# EAGLE design max_plate (EAGLE 7.2.0)
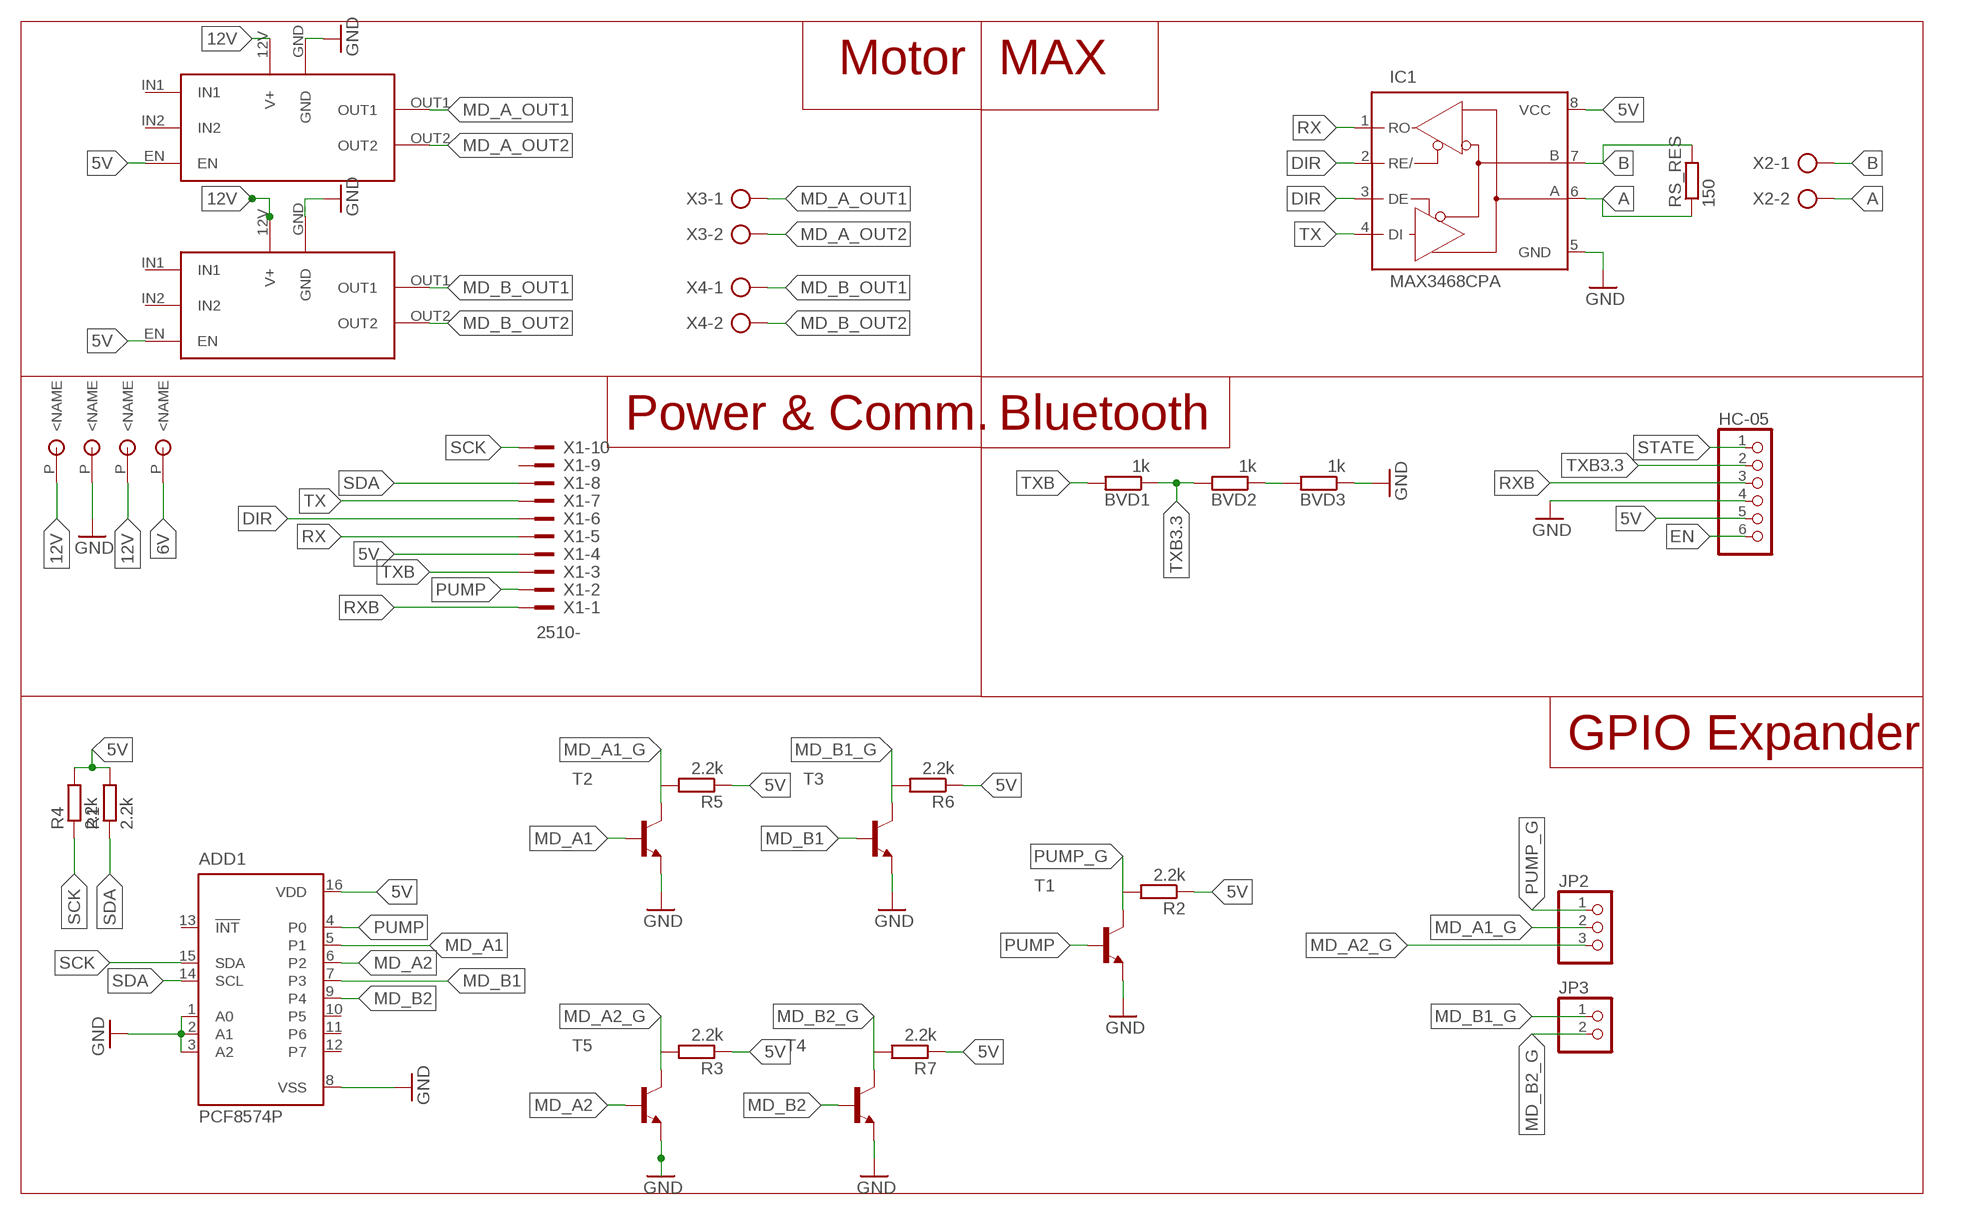
[diagram p0: schematic, sheet 1]

## Parts
ADD1  PCF8574P  [DIL16]
BVD1  1k  R-EU_0207/10  [0207/10]
BVD2  1k  R-EU_0207/10  [0207/10]
BVD3  1k  R-EU_0207/10  [0207/10]
HC-05  PINHD-1X6  [1X06]
IC1  MAX3468CPA  [DIL08]
JP2  PINHD-1X3  [1X03]
JP3  PINHD-1X2  [1X02]
R1  2.2k  R-EU_0207/10  [0207/10]
R2  2.2k  R-EU_0207/10  [0207/10]
R3  2.2k  R-EU_0207/10  [0207/10]
R4  2.2k  R-EU_0207/10  [0207/10]
R5  2.2k  R-EU_0207/10  [0207/10]
R6  2.2k  R-EU_0207/10  [0207/10]
R7  2.2k  R-EU_0207/10  [0207/10]
RS_RES  150  R-EU_0207/10  [0207/10]
T1  -NPN-TO92  [TO92]
T2  -NPN-TO92  [TO92]
T3  -NPN-TO92  [TO92]
T4  -NPN-TO92  [TO92]
T5  -NPN-TO92  [TO92]
U$1  CU-SPACER  [CU-SPACER]
U$2  CU-SPACER  [CU-SPACER]
U$3  CU-SPACER  [CU-SPACER]
U$4  CU-SPACER  [CU-SPACER]
U$5  L6203-MODULE  [L6203-MODULE]
U$6  L6203-MODULE  [L6203-MODULE]
X1  2510-  [PAK100/2500-10]
X2  AK500/2  [AK500/2]
X3  AK500/2  [AK500/2]
X4  AK500/2  [AK500/2]

## Nets
5V: ADD1.16(VDD) HC-05.5 IC1.8(VCC) R1.2 R2.1 R3.1 R4.2 R5.1 R6.1 R7.1 U$5.EN U$6.EN X1.4
6V: U$4.P(<NAME)
12V: U$1.P(<NAME) U$3.P(<NAME) U$5.12V(V+) U$6.12V(V+)
A: IC1.6(A) RS_RES.1 X2.2
B: IC1.7(B) RS_RES.2 X2.1
DIR: IC1.2(RE/) IC1.3(DE) X1.6
EN: HC-05.6
GND: ADD1.1(A0) ADD1.2(A1) ADD1.3(A2) ADD1.8(VSS) BVD3.1 HC-05.4 IC1.5(GND) T1.1(E) T2.1(E) T3.1(E) T4.1(E) T5.1(E) U$2.P(<NAME) U$5.GND U$6.GND
MD_A1: ADD1.5(P1) T2.2(B)
MD_A1_G: JP2.2 R5.2 T2.3(C)
MD_A2: ADD1.6(P2) T5.2(B)
MD_A2_G: JP2.3 R3.2 T5.3(C)
MD_A_OUT1: U$5.OUT1 X3.1
MD_A_OUT2: U$5.OUT2 X3.2
MD_B1: ADD1.7(P3) T3.2(B)
MD_B1_G: JP3.1 R6.2 T3.3(C)
MD_B2: ADD1.9(P4) T4.2(B)
MD_B2_G: JP3.2 R7.2 T4.3(C)
MD_B_OUT1: U$6.OUT1 X4.1
MD_B_OUT2: U$6.OUT2 X4.2
N$3: BVD2.1 BVD3.2
PUMP: ADD1.4(P0) T1.2(B) X1.2
PUMP_G: JP2.1 R2.2 T1.3(C)
RX: IC1.1(RO) X1.5
RXB: HC-05.3 X1.1
SCK: ADD1.15(SDA) R4.1 X1.10
SDA: ADD1.14(SCL) R1.1 X1.8
STATE: HC-05.1
TX: IC1.4(DI) X1.7
TXB: BVD1.2 X1.3
TXB3.3: BVD1.1 BVD2.2 HC-05.2
Unconnected: ADD1.10(P5) ADD1.11(P6) ADD1.12(P7) ADD1.13(!INT) U$5.IN1 U$5.IN2 U$6.IN1 U$6.IN2 X1.9

## Notes on the sheet
- Motor | MAX
- Power & Comm. | Bluetooth
- GPIO Expander

## Library data of the parts
ADD1 = micro-philips:PCF8574: I2C-Bus Remote 8-bit I/O expander http://www.semiconductors.philips.com/acrobat_download/datasheets/PCF8574_4.pdf; MPN: PCF8574PN; OC_FARNELL: 204020; OC_NEWARK: 11N8515
BVD1-BVD3 R1-R7 RS_RES = rcl:R-EU_: RESISTOR, European symbol
HC-05 = pinhead:PINHD-1X6: PIN HEADER
IC1 = maxim:MAX34*: +5V, Fail-Safe, 40Mbps, Profibus RS-485/RS-422 Transceivers Source: MAX3465-MAX3469.pdf; OC_FARNELL: unknown; OC_NEWARK: unknown
JP2 = pinhead:PINHD-1X3: PIN HEADER
JP3 = pinhead:PINHD-1X2: PIN HEADER
T1-T5 = transistor:*-NPN-: NPN Transistror BF959 corrected 2008.03.06
U$1-U$4 = Aquaphoton:CU-SPACER
U$5 U$6 = Aquaphoton:L6203-MODULE
X1 = con-3m:2510-: 3M (TM) Pak 100 4-Wall Header Source: 3M; MF: 3M; MPN: 2510-6002UB; OC_FARNELL: 9838244; OC_NEWARK: 46F4725
X2-X4 = con-ptr500:AK500/2: CONNECTOR; OC_FARNELL: unknown; OC_NEWARK: unknown

## Board
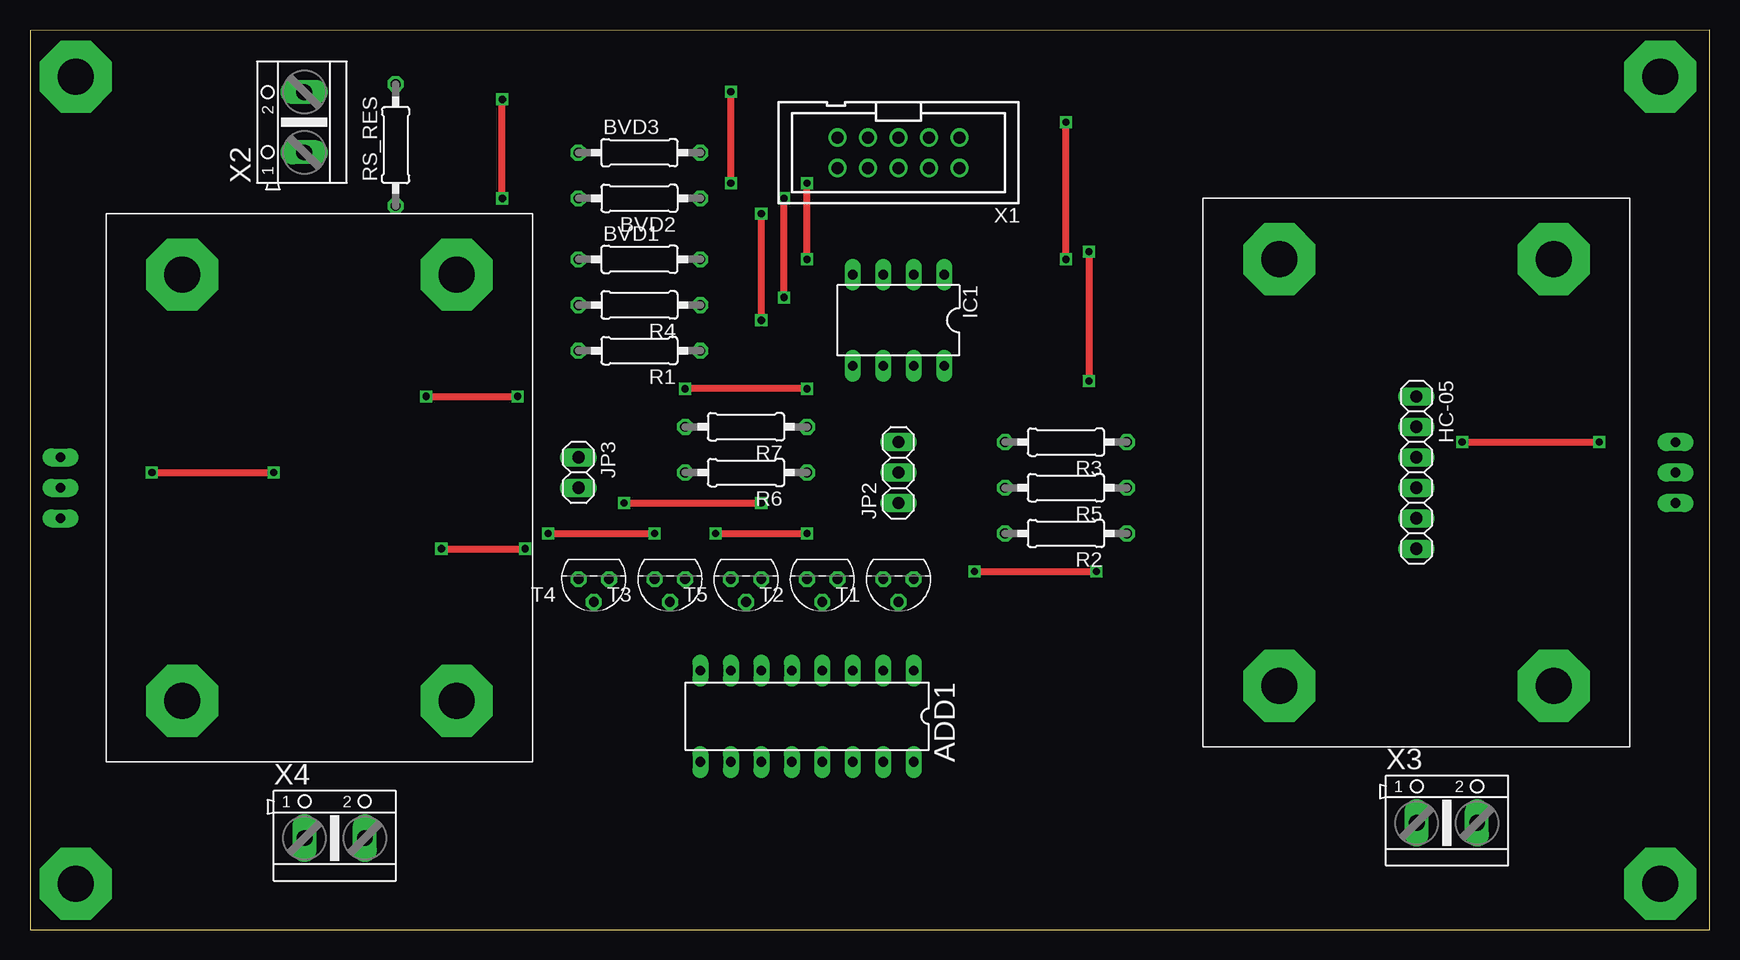
[diagram p1: board, top side]
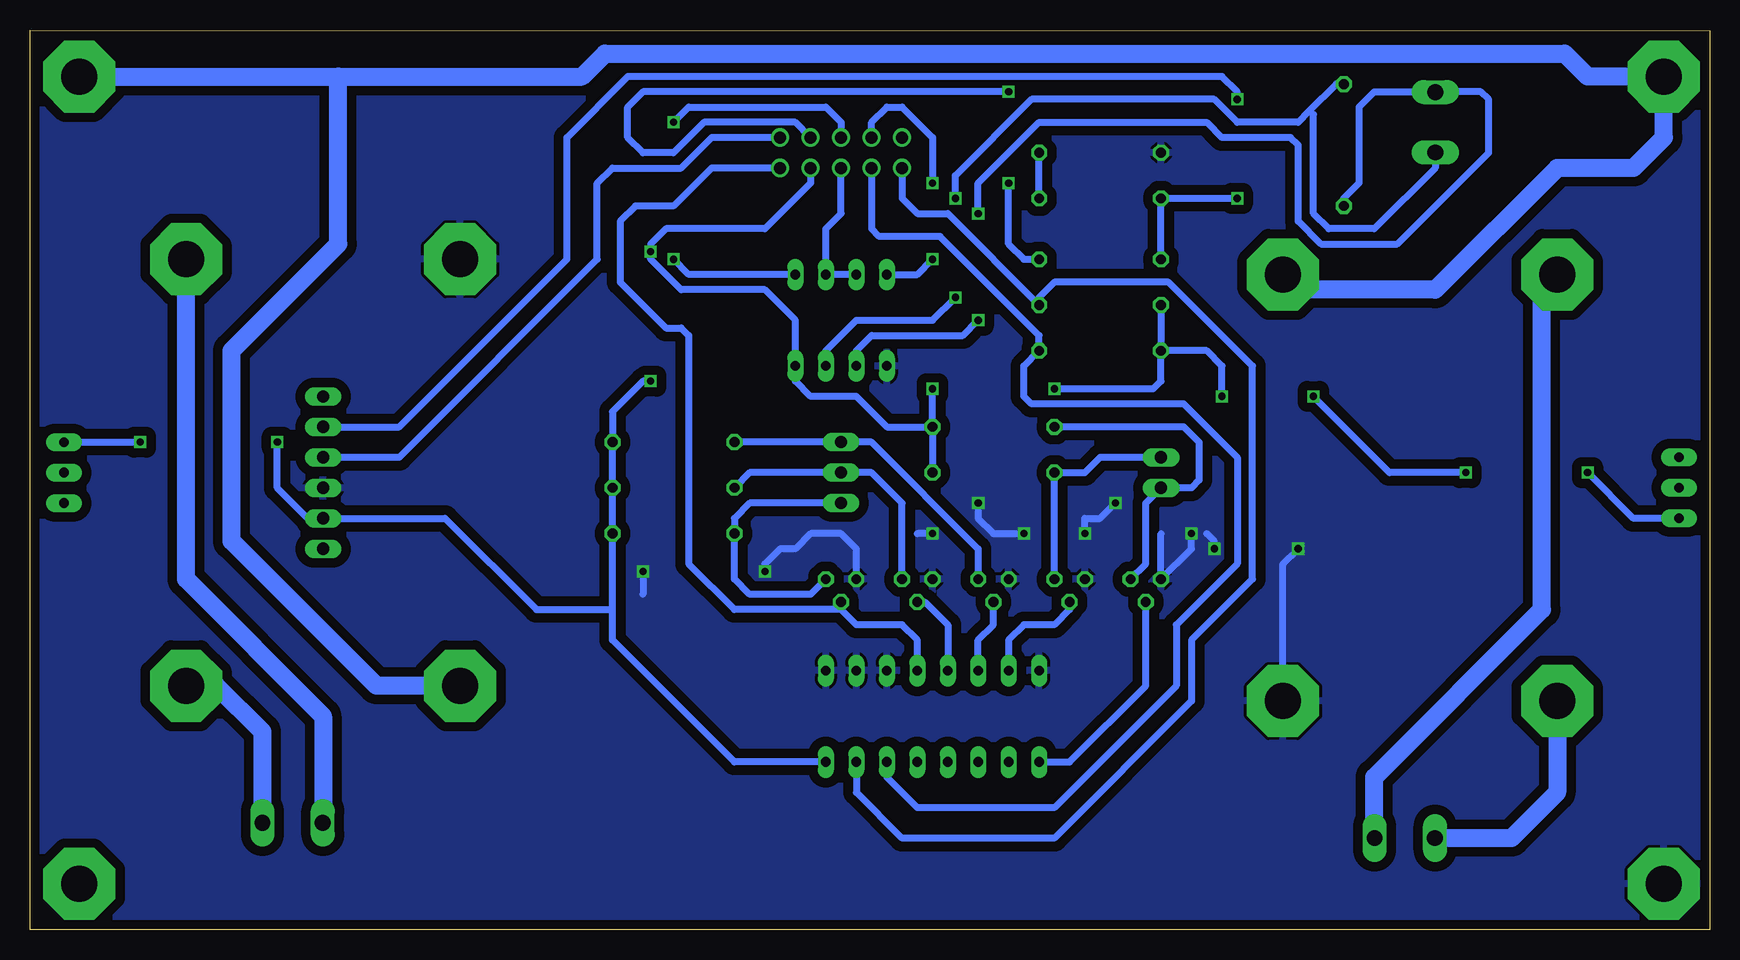
[diagram p2: board, bottom side, seen from below]

Size 140 x 75 mm. Coordinates in mm from the lower left corner, seen from the top.
Outline: 0,0 140,0 140,75 0,74.93 0,0
Copper layers (1*16): Top 0.035mm / dielectric 1.5mm / Bottom 0.035mm
Design rules "default *": minimum track width 0.8mm, minimum drill 0.8mm, track to track 0.8mm, track to pad 0.8mm, pad to pad 0.8mm, via to via 0.8mm, smd to smd 0.8mm, copper to edge 0.8mm, drill to drill 0.8mm, minimum pad ring 10mil, minimum via ring 8mil, stop-mask expansion 4mil, vias tented up to drill 0mil, thermal gap 10mil

### Footprints (pad centres in the part's own frame; a part is rotated, then mirrored left to right if it is on the bottom)
DIL16 = drill 0.813 long: 1 -8.89,-3.81; 2 -6.35,-3.81; 3 -3.81,-3.81; 4 -1.27,-3.81; 5 1.27,-3.81; 6 3.81,-3.81; 7 6.35,-3.81; 8 8.89,-3.81; 9 8.89,3.81; 10 6.35,3.81; 11 3.81,3.81; 12 1.27,3.81; 13 -1.27,3.81; 14 -3.81,3.81; 15 -6.35,3.81; 16 -8.89,3.81
0207/10 = drill 0.813 octagon: 1 -5.08,0; 2 5.08,0
1X06 = drill 1.016 long: 1 -6.35,0; 2 -3.81,0; 3 -1.27,0; 4 1.27,0; 5 3.81,0; 6 6.35,0
DIL08 = drill 0.813 long: 1 -3.81,-3.81; 2 -1.27,-3.81; 3 1.27,-3.81; 4 3.81,-3.81; 5 3.81,3.81; 6 1.27,3.81; 7 -1.27,3.81; 8 -3.81,3.81
1X03 = drill 1.016 long: 1 -2.54,0; 2 0,0; 3 2.54,0
1X02 = drill 1.016 long: 1 -1.27,0; 2 1.27,0
TO92 = drill 0.813 octagon: 1 1.27,0; 2 0,1.905; 3 -1.27,0
CU-SPACER = drill 3 pad 6 octagon: P 0,0
L6203-MODULE = drill 3 pad 6 octagon: 12V 5.08,29.21; GND 40.64,29.21; OUT1 40.64,6.35; OUT2 5.08,6.35 | drill 0.8 pad 1.5 long: EN 25.4,-3.81; IN1 20.32,-3.81; IN2 22.86,-3.81
PAK100/2500-10 = drill 1 pad 1.422: 1 -5.08,-1.27; 2 -5.08,1.27; 3 -2.54,-1.27; 4 -2.54,1.27; 5 0,-1.27; 6 0,1.27; 7 2.54,-1.27; 8 2.54,1.27; 9 5.08,-1.27; 10 5.08,1.27
AK500/2 = drill 1.321 long: 1 -2.515,0; 2 2.515,0

### Placement (x,y rotation side)
ADD1  64.77,17.78 180 top
BVD1  50.8,55.88 0 top
BVD2  50.8,60.96 180 top
BVD3  50.8,64.77 0 top
HC-05  115.57,38.1 270 top
IC1  72.39,50.8 180 top
JP2  72.39,38.1 90 top
JP3  45.72,38.1 270 top
R1  50.8,48.26 180 top
R2  86.36,33.02 180 top
R3  86.36,40.64 180 top
R4  50.8,52.07 180 top
R5  86.36,36.83 180 top
R6  59.69,38.1 180 top
R7  59.69,41.91 180 top
RS_RES  30.48,65.41 90 top
T1  72.39,29.21 180 top
T2  66.04,29.21 180 top
T3  53.34,29.21 180 top
T4  46.99,29.21 180 top
T5  59.69,29.21 180 top
U$1  135.89,71.12 0 top
U$2  3.81,3.81 0 top
U$3  3.81,71.12 0 top
U$4  135.89,3.81 0 top
U$5  133.35,15.24 90 top
U$6  6.35,59.69 270 top
X1  72.39,64.77 180 top
X2  22.86,67.31 90 top
X3  118.11,8.89 0 top
X4  25.4,7.62 0 top

### Tracks (layer width: path | path; a pad name or v marks a point on that pad's centre or on a via)
5V  (via drill 0.6)
  Top 0.6: v119.38,40.64 v130.81,40.64 | v88.27,56.52 v88.27,45.72 | v10.16,38.1 v20.32,38.1 | v33.02,44.45 v40.64,44.45 | v64.77,45.09 v54.61,45.09
  Bottom 0.6: ADD1.16 81.28,13.97 91.44,24.13 91.44,26.67 | 91.44,26.67 R2.1 R5.1 R3.1 91.44,43.18 88.9,45.72 v88.27,45.72 | R7.1 R6.1 | R4.2 R1.2 | R7.1 68.58,41.91 71.12,44.45 74.93,44.45 76.2,45.72 IC1.8 76.2,50.8 78.74,53.34 85.72,53.34 88.27,55.88 v88.27,56.52 88.27,57.15 87,58.42 78.74,58.42 74.93,62.23 X1.4 | U$5.EN v130.81,40.64 | 91.44,26.67 97.79,26.67 105.41,34.29 HC-05.5 116.84,34.29 119.38,36.83 v119.38,40.64 | U$6.EN 6.35,34.29 v10.16,38.1 | v20.32,38.1 26.67,38.1 v33.02,44.45 | v40.64,44.45 40.64,46.99 41.91,48.26 R1.2 | R7.1 v64.77,45.09 | v54.61,45.09 46.35,45.09 45.72,45.72 R1.2
12V
  Bottom 1.5: U$6.12V 34.29,53.34 22.86,53.34 12.7,63.5 6.35,63.5 3.81,66.04 U$3.P 10.16,71.12 12.06,73.03 92.08,73.03 93.98,71.12 114.3,71.12 | U$1.P 114.3,71.12 | U$5.12V 111.12,20.32 123.19,32.38 123.19,48.26 114.3,57.15 114.3,71.12
A  (via drill 0.6)
  Top 0.6: v60.96,50.8 v60.96,59.69
  Bottom 0.6: IC1.6 71.12,48.26 69.85,49.53 62.23,49.53 v60.96,50.8 | v60.96,59.69 60.96,62.23 55.88,67.31 41.91,67.31 40.64,66.04 34.92,66.04 34.29,65.41 34.29,59.05 32.38,57.15 26.04,57.15 18.41,64.77 18.41,69.22 19.05,69.85 22.84,69.85 X2.2 27.96,69.83 29.21,68.58 29.21,62.23 30.48,60.96 RS_RES.1
B  (via drill 0.6)
  Top 0.6: v62.87,52.7 v62.87,60.96
  Bottom 0.6: IC1.7 73.66,48.26 71.12,50.8 64.77,50.8 v62.87,52.7 | v62.87,60.96 62.87,62.87 56.52,69.22 41.27,69.22 39.37,67.31 34.29,67.31 33.34,68.26 | X2.1 22.86,63.5 27.94,58.42 31.75,58.42 33.02,59.69 33.02,67.94 33.34,68.26 | 33.34,68.26 31.11,70.48 RS_RES.2
DIR
  Bottom 0.6: IC1.3 IC1.2 73.66,58.42 72.39,59.69 X1.6
GND  (via drill 0.6)
  Top 0.6: v43.18,33.02 v52.07,33.02 | v49.53,35.56 v60.96,35.56 | v57.15,33.02 v64.77,33.02 | v78.74,29.84 v88.9,29.84 | v34.29,31.75 v41.27,31.75
  Bottom 0.6: 45.72,33.02 T4.1 43.18,31.75 v43.18,33.02 | v52.07,33.02 52.07,34.29 50.8,34.29 v49.53,35.56 | v60.96,35.56 60.96,34.29 59.69,33.02 v57.15,33.02 | v64.77,33.02 66.04,33.02 | T1.1 71.12,31.75 72.39,33.02 74.93,33.02 76.2,31.75 77.47,31.75 78.74,30.48 v78.74,29.84 | v88.9,29.84 88.9,27.94 | U$6.GND 35.56,30.48 v34.29,31.75 | v41.27,31.75 41.27,32.38 41.91,33.02
  pour Bottom: 0,74.93 140.97,74.93 140.97,-1.27 0,-1.27
MD_A1
  Bottom 0.6: ADD1.5 63.5,25.4 65.41,27.3 T2.2
MD_A1_G
  Bottom 0.6: T2.3 67.31,35.56 69.85,38.1 JP2.2 80.01,38.1 R5.2
MD_A2
  Bottom 0.6: ADD1.6 60.96,24.13 59.69,25.4 T5.2
MD_A2_G
  Bottom 0.6: R3.2 JP2.3 69.85,40.64 60.96,31.75 T5.3
MD_A_OUT1
  Bottom 1.5: U$5.OUT1 127,29.21 115.57,17.78 115.57,8.91 X3.1
MD_A_OUT2
  Bottom 1.5: X3.2 120.62,16.48 124.46,20.32 U$5.OUT2 128.27,20.32
MD_B1
  Bottom 0.6: ADD1.7 58.42,24.13 57.15,25.4 54.61,25.4 53.34,26.67 T3.2
MD_B1_G
  Bottom 0.6: JP3.1 50.8,39.37 52.07,38.1 R6.2 T3.3
MD_B2
  Bottom 0.6: ADD1.9 53.34,13.97 46.99,20.32 T4.2
MD_B2_G
  Bottom 0.6: JP3.2 44.45,36.83 | R7.2 43.81,41.91 42.55,40.64 42.55,37.47 43.18,36.83 JP3.2 | JP3.2 46.99,35.56 46.99,30.48 T4.3
MD_B_OUT1
  Bottom 1.5: U$6.OUT1 12.7,11.43 16.51,7.62 X4.1
MD_B_OUT2
  Bottom 1.5: U$6.OUT2 13.97,53.34 13.97,26.67 27.94,12.7 27.94,6.38 X4.2
N$3
  Bottom 0.6: BVD2.1 BVD3.2
PUMP
  Bottom 0.6: ADD1.4 66.04,24.13 67.31,25.4 71.12,25.4 72.39,26.67 | X1.2 83.19,63.5 86.36,60.33 89.53,60.33 90.81,59.05 90.81,53.98 87,50.16 85.72,50.16 85.09,49.53 85.09,30.48 81.28,26.67 72.39,26.67 | 72.39,26.67 T1.2
PUMP_G
  Bottom 0.6: JP2.1 80.01,35.56 81.28,34.29 R2.2 | 81.28,31.75 R2.2 | T1.3 74.93,27.94 80.01,27.94 81.28,29.21 R2.2
RX  (via drill 0.6)
  Top 0.6: v86.36,55.88 v86.36,67.31
  Bottom 0.6: IC1.1 85.09,54.61 v86.36,55.88 | v86.36,67.31 85.09,68.58 73.66,68.58 72.39,67.31 X1.5
RXB
  Bottom 0.6: HC-05.3 109.22,39.37 92.71,55.88 92.71,62.23 91.44,63.5 85.72,63.5 83.19,66.04 X1.1
SCK
  Bottom 0.6: X1.10 67.31,60.96 66.04,59.69 63.5,59.69 R4.1 55.88,52.7 54.61,53.98 45.09,53.98 38.1,46.99 38.1,29.21 43.18,24.13 43.18,19.05 54.61,7.62 67.31,7.62 71.12,11.43 ADD1.15
SDA
  Bottom 0.6: X1.8 69.85,58.42 69.22,57.78 64.14,57.78 55.88,49.53 R1.1 57.15,46.99 57.15,44.45 56.52,43.81 43.81,43.81 39.37,39.37 39.37,30.48 44.45,25.4 44.45,20.32 54.61,10.16 66.04,10.16 68.58,12.7 ADD1.14
TX  (via drill 0.6)
  Top 0.6: v64.77,55.88 v64.77,62.23
  Bottom 0.6: IC1.4 66.04,54.61 v64.77,55.88 | X1.7 69.85,67.31 68.58,68.58 67.31,68.58 64.77,66.04 v64.77,62.23
TXB  (via drill 0.6)
  Top 0.6: v58.42,62.23 v58.42,69.85
  Bottom 0.6: BVD1.2 57.15,55.88 58.42,57.15 v58.42,62.23 | v58.42,69.85 88.9,69.85 90.17,68.58 90.17,66.04 88.9,64.77 86.36,64.77 83.82,67.31 76.2,67.31 X1.3
TXB3.3  (via drill 0.6)
  Top 0.6: v39.37,60.96 v39.37,69.22
  Bottom 0.6: BVD1.1 BVD2.2 v39.37,60.96 | HC-05.2 109.22,41.91 95.25,55.88 95.25,66.04 90.17,71.12 40.64,71.12 39.37,69.85 v39.37,69.22